# EAGLE schematic Gas_Sensor (EAGLE 6.4)
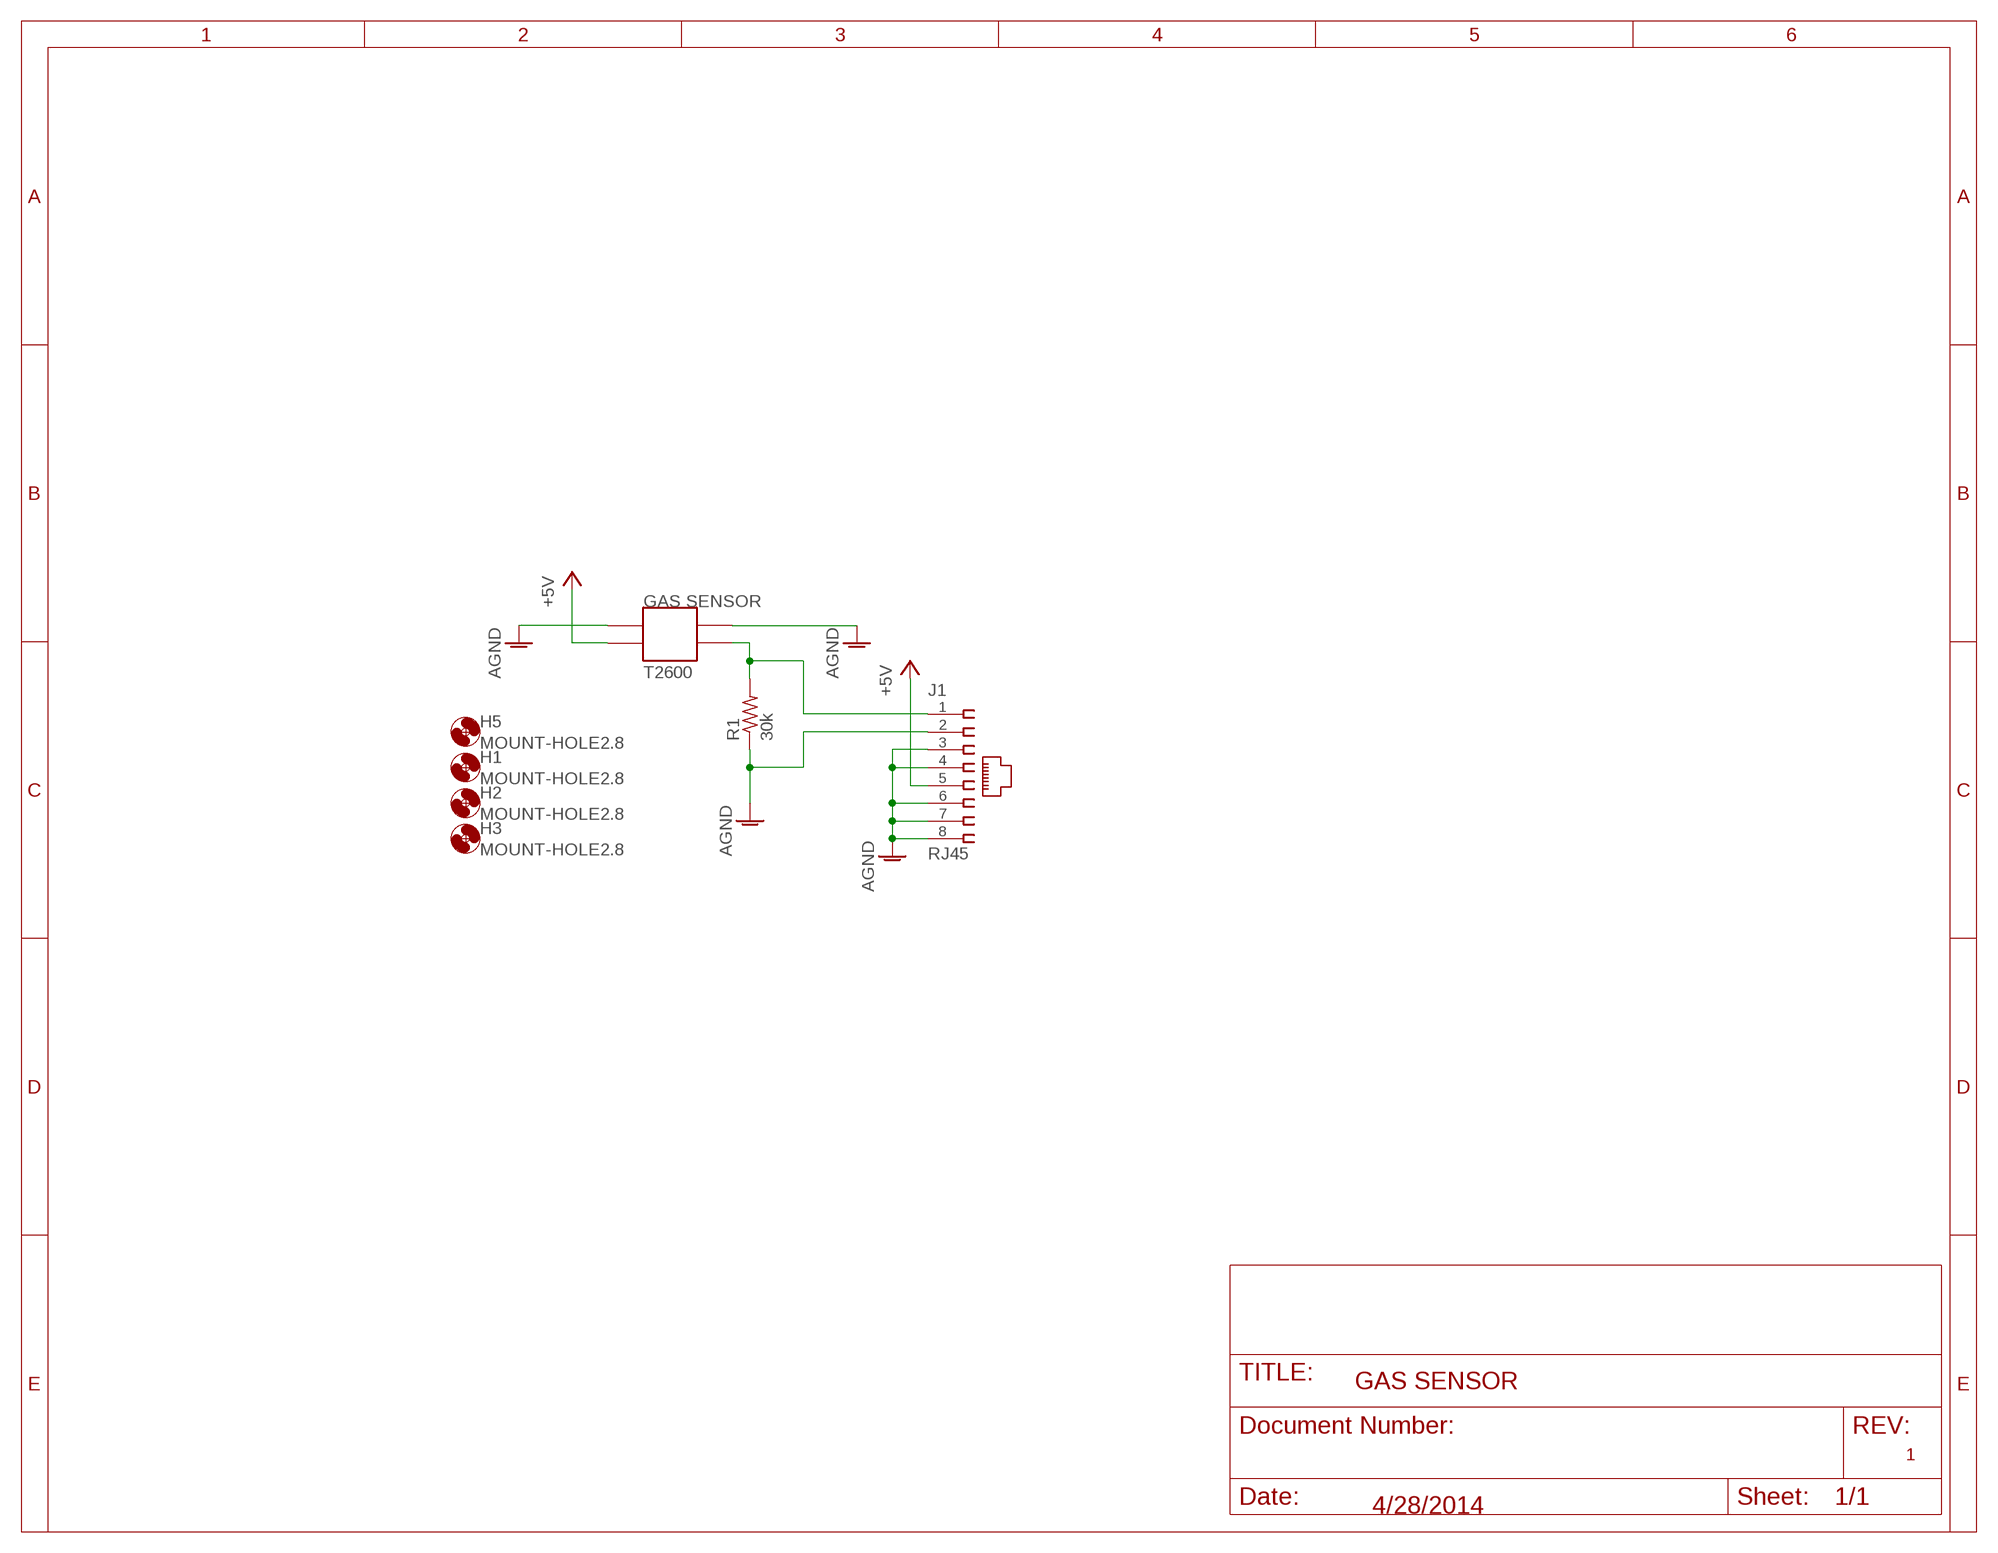
[diagram p0: schematic, sheet 1]

## Parts
H1  MOUNT-HOLE2.8  [2,8]
H2  MOUNT-HOLE2.8  [2,8]
H3  MOUNT-HOLE2.8  [2,8]
H5  MOUNT-HOLE2.8  [2,8]
J1  RJ45  555167-1  [555167-1]
R1  30k  R-US_R1206  [R1206]
U$1  GAS_SENSOR  [GAS_SENSOR]

## Nets
+5V: J1.5 U$1.P$3
AGND: J1.2 J1.3 J1.4 J1.6 J1.7 J1.8 R1.1 U$1.P$1 U$1.P$2
N$2: J1.1 R1.2 U$1.P$4

## Notes on the sheet
- GAS SENSOR
- T2600
- GAS SENSOR
- 1
- 4/28/2014

## Library data of the parts
H1-H3 H5 = holes:MOUNT-HOLE: MOUNTING HOLE with drill center marker
J1 = con-amp:555167-1: AMP connector
R1 = rcl:R-US_: RESISTOR, American symbol
U$1 = figaro:GAS_SENSOR